# Altium schematic sheet ETRX_Shield.SchDoc
size A4; DocumentNumber: 1; SheetNumber: 1; SheetTotal: 4
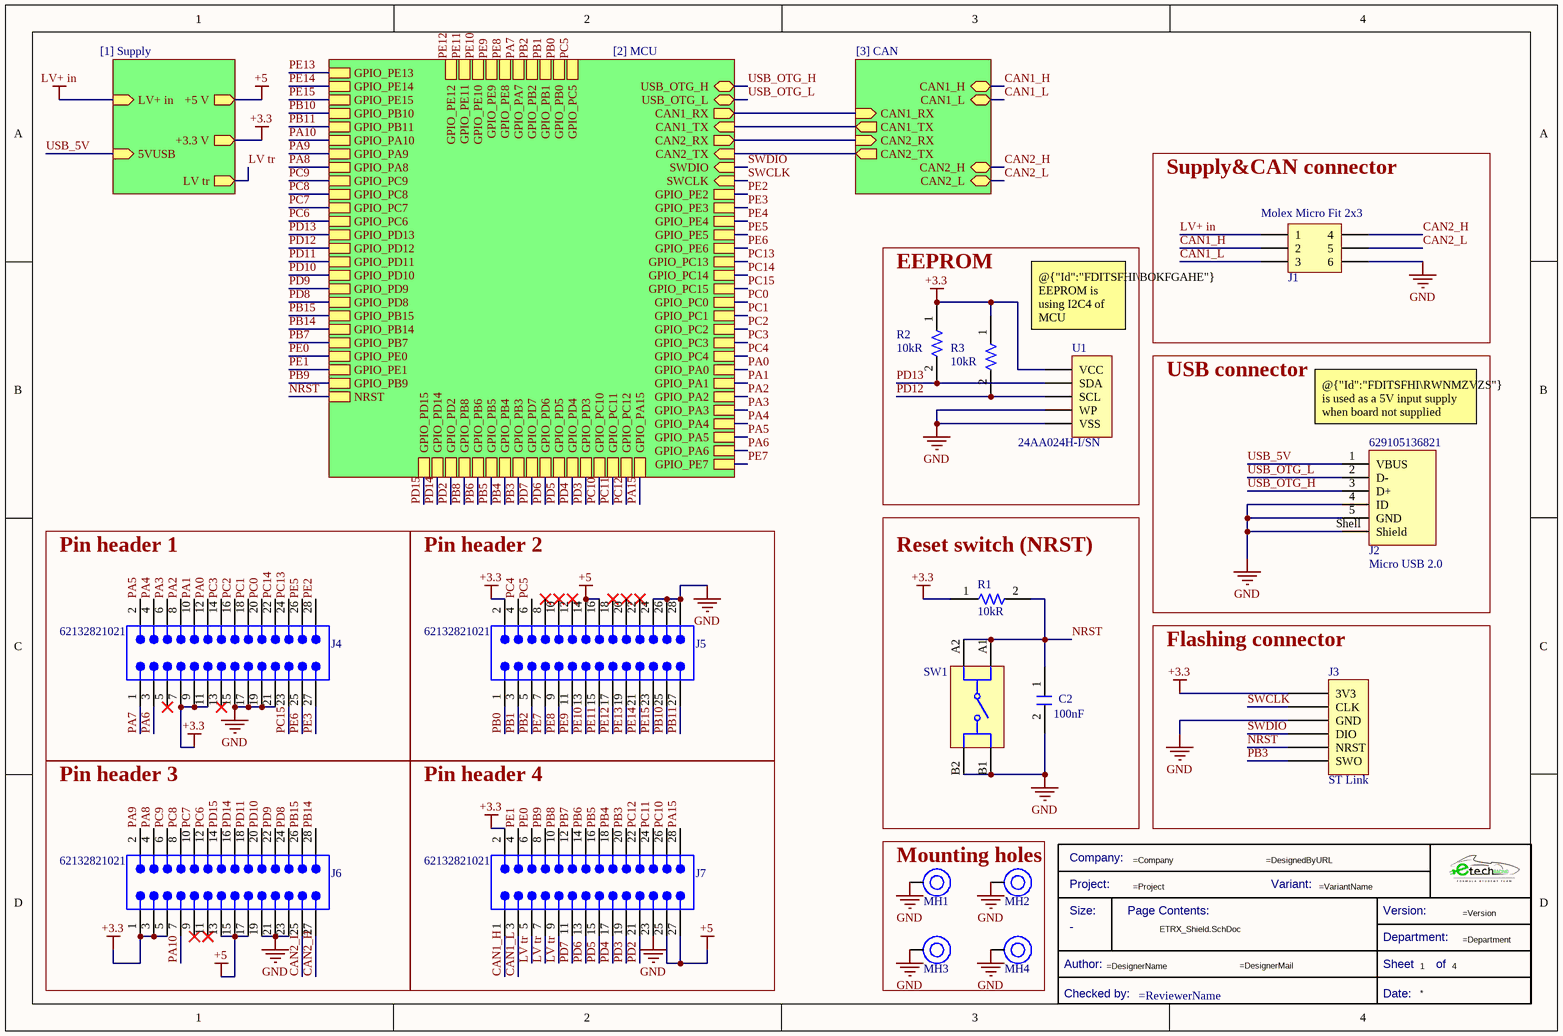
[diagram p0: ETRX_Shield.SchDoc]

## Parts
*  Title Block_template  (value not drawn)  (graphical)
C2  Capacitance: 100nF  [C0805FNPC-R]  (hidden comment: 885012207098)
J1  Molex Micro Fit 2x3  [J_MicroFit_2x3_V]
J2  629105136821  [629105136821]
J3  ST Link  [J_STLink_PinHeader]
J4  62132821021  [62132821021]
J5  62132821021  [62132821021]
J6  62132821021  [62132821021]
J7  62132821021  [62132821021]
MH1  Mounting_Hole_M3  [Mounting_Hole_M3]  (value not drawn)
MH2  Mounting_Hole_M3  [Mounting_Hole_M3]  (value not drawn)
MH3  Mounting_Hole_M3  [Mounting_Hole_M3]  (value not drawn)
MH4  Mounting_Hole_M3  [Mounting_Hole_M3]  (value not drawn)
R1  Resistance: 10kR  [R0805FTK]  (hidden comment: CR0805-JW-103ELF)
R2  Resistance: 10kR  [R0805FTK]  (hidden comment: CR0805-JW-103ELF)
R3  Resistance: 10kR  [R0805FTK]  (hidden comment: CR0805-JW-103ELF)
SW1  430773034825  [WS-TASV_L6W6H3.4_4307x30348xx]  (value not drawn)
U1  24AA024H-I/SN  [SOIC, 8-Leads 1,27mm]

## Blocks framed on the sheet
Supply&CAN connector: J1
EEPROM: R2 R3 U1
USB connector: J2
Reset switch (NRST): C2 R1 SW1
Pin header 1: J4
Pin header 2: J5
Flashing connector: J3
Pin header 3: J6
Pin header 4: J7
Mounting holes: MH1-MH4

## Sub-sheets
[1] Supply = [1] Supply: LV+ in (in), +5 V (out), +3.3 V (out), LV tr (out), 5VUSB (in)
[2] MCU = [2] MCU: CAN1_RX (out), CAN1_TX (in), CAN2_RX (out), CAN2_TX (in), USB_OTG_H (bidir), USB_OTG_L (bidir), SWDIO (in), SWCLK (in), GPIO_PE2, GPIO_PE3, GPIO_PE4, GPIO_PE5, GPIO_PC13, GPIO_PC14, GPIO_PC15, GPIO_PC0, GPIO_PC1, GPIO_PC2, GPIO_PC3, GPIO_PA0, GPIO_PA1, GPIO_PA2, GPIO_PA3, GPIO_PA4, GPIO_PA5, GPIO_PC4, GPIO_PC5, GPIO_PB0, GPIO_PB1, GPIO_PB2, GPIO_PE8, GPIO_PE9, GPIO_PE10, GPIO_PE11, GPIO_PE12, GPIO_PE13, GPIO_PE14, GPIO_PE15, GPIO_PB10, GPIO_PB11, GPIO_PA8, GPIO_PC9, GPIO_PC8, GPIO_PC7, GPIO_PC6, GPIO_PD13, GPIO_PD12, GPIO_PD11, GPIO_PD10, GPIO_PD9, GPIO_PD8, GPIO_PB15, GPIO_PB14, GPIO_PB7, GPIO_PE1, GPIO_PE0, GPIO_PB9, GPIO_PB8, GPIO_PB6, GPIO_PB5, GPIO_PB4, GPIO_PB3, GPIO_PD7, GPIO_PD6, GPIO_PD5, GPIO_PD4, GPIO_PD3, GPIO_PD2, GPIO_PC12, GPIO_PC11, GPIO_PC10, GPIO_PA15, GPIO_PA10, GPIO_PE6, GPIO_PA6, GPIO_PA7, GPIO_PE7, NRST, GPIO_PD14, GPIO_PD15, GPIO_PA9
[3] CAN = [3] CAN: CAN1_H (bidir), CAN1_L (bidir), CAN2_H (bidir), CAN2_L (bidir), CAN1_RX (in), CAN2_RX (in), CAN1_TX (out), CAN2_TX (out)

## Nets
+3.3: J3.1(3V3) J4.7 J4.9 J4.11 J5.2 J6.1 J6.3 J6.5 J7.2 R1.1 R2.1 R3.1 U1.8(VCC) ; sheet [1] Supply/+3.3 V
+5: J5.14 J5.16 J6.13 J6.15 J6.17 J7.25 J7.27 ; sheet [1] Supply/+5 V
GND: C2.2 J1.6 J2.4(ID) J2.5(GND) J2.Shell(Shield) J3.3(GND) J4.15 J4.17 J4.19 J4.21 J5.24 J5.26 J5.28 J6.19 J6.21 J6.23 J7.23 MH1.1 MH2.1 MH3.1 MH4.1 SW1.B1 SW1.B2 U1.4(VSS) U1.7(WP)
LV+ in: J1.1 ; sheet [1] Supply/LV+ in
CAN1_H: J1.2 J7.1 ; sheet [3] CAN/CAN1_H
CAN1_L: J1.3 J7.3 ; sheet [3] CAN/CAN1_L
CAN2_H: J1.4 J6.27 ; sheet [3] CAN/CAN2_H
CAN2_L: J1.5 J6.25 ; sheet [3] CAN/CAN2_L
LV tr: J7.5 J7.7 J7.9 ; sheet [1] Supply/LV tr
NRST: C2.1 J3.5(NRST) R1.2 SW1.A1 SW1.A2 ; sheet [2] MCU/NRST
PA0: J4.12 ; sheet [2] MCU/GPIO_PA0
PA1: J4.10 ; sheet [2] MCU/GPIO_PA1
PA2: J4.8 ; sheet [2] MCU/GPIO_PA2
PA3: J4.6 ; sheet [2] MCU/GPIO_PA3
PA4: J4.4 ; sheet [2] MCU/GPIO_PA4
PA5: J4.2 ; sheet [2] MCU/GPIO_PA5
PA6: J4.3 ; sheet [2] MCU/GPIO_PA6
PA7: J4.1 ; sheet [2] MCU/GPIO_PA7
PA8: J6.4 ; sheet [2] MCU/GPIO_PA8
PA9: J6.2 ; sheet [2] MCU/GPIO_PA9
PA10: J6.7 ; sheet [2] MCU/GPIO_PA10
PA15: J7.28 ; sheet [2] MCU/GPIO_PA15
PB0: J5.1 ; sheet [2] MCU/GPIO_PB0
PB1: J5.3 ; sheet [2] MCU/GPIO_PB1
PB2: J5.5 ; sheet [2] MCU/GPIO_PB2
PB3: J3.6(SWO) J7.20 ; sheet [2] MCU/GPIO_PB3
PB4: J7.18 ; sheet [2] MCU/GPIO_PB4
PB5: J7.16 ; sheet [2] MCU/GPIO_PB5
PB6: J7.14 ; sheet [2] MCU/GPIO_PB6
PB7: J7.12 ; sheet [2] MCU/GPIO_PB7
PB8: J7.10 ; sheet [2] MCU/GPIO_PB8
PB9: J7.8 ; sheet [2] MCU/GPIO_PB9
PB10: J5.25 ; sheet [2] MCU/GPIO_PB10
PB11: J5.27 ; sheet [2] MCU/GPIO_PB11
PB14: J6.28 ; sheet [2] MCU/GPIO_PB14
PB15: J6.26 ; sheet [2] MCU/GPIO_PB15
PC0: J4.20 ; sheet [2] MCU/GPIO_PC0
PC1: J4.18 ; sheet [2] MCU/GPIO_PC1
PC2: J4.16 ; sheet [2] MCU/GPIO_PC2
PC3: J4.14 ; sheet [2] MCU/GPIO_PC3
PC4: J5.4 ; sheet [2] MCU/GPIO_PC4
PC5: J5.6 ; sheet [2] MCU/GPIO_PC5
PC6: J6.12 ; sheet [2] MCU/GPIO_PC6
PC7: J6.10 ; sheet [2] MCU/GPIO_PC7
PC8: J6.8 ; sheet [2] MCU/GPIO_PC8
PC9: J6.6 ; sheet [2] MCU/GPIO_PC9
PC10: J7.26 ; sheet [2] MCU/GPIO_PC10
PC11: J7.24 ; sheet [2] MCU/GPIO_PC11
PC12: J7.22 ; sheet [2] MCU/GPIO_PC12
PC13: J4.24 ; sheet [2] MCU/GPIO_PC13
PC14: J4.22 ; sheet [2] MCU/GPIO_PC14
PC15: J4.23 ; sheet [2] MCU/GPIO_PC15
PD2: J7.21 ; sheet [2] MCU/GPIO_PD2
PD3: J7.19 ; sheet [2] MCU/GPIO_PD3
PD4: J7.17 ; sheet [2] MCU/GPIO_PD4
PD5: J7.15 ; sheet [2] MCU/GPIO_PD5
PD6: J7.13 ; sheet [2] MCU/GPIO_PD6
PD7: J7.11 ; sheet [2] MCU/GPIO_PD7
PD8: J6.24 ; sheet [2] MCU/GPIO_PD8
PD9: J6.22 ; sheet [2] MCU/GPIO_PD9
PD10: J6.20 ; sheet [2] MCU/GPIO_PD10
PD11: J6.18 ; sheet [2] MCU/GPIO_PD11
PD12: R3.2 U1.6(SCL) ; sheet [2] MCU/GPIO_PD12
PD13: R2.2 U1.5(SDA) ; sheet [2] MCU/GPIO_PD13
PD14: J6.16 ; sheet [2] MCU/GPIO_PD14
PD15: J6.14 ; sheet [2] MCU/GPIO_PD15
PE0: J7.6 ; sheet [2] MCU/GPIO_PE0
PE1: J7.4 ; sheet [2] MCU/GPIO_PE1
PE2: J4.28 ; sheet [2] MCU/GPIO_PE2
PE3: J4.27 ; sheet [2] MCU/GPIO_PE3
PE4: sheet [2] MCU/GPIO_PE4
PE5: J4.26 ; sheet [2] MCU/GPIO_PE5
PE6: J4.25 ; sheet [2] MCU/GPIO_PE6
PE7: J5.7 ; sheet [2] MCU/GPIO_PE7
PE8: J5.9 ; sheet [2] MCU/GPIO_PE8
PE9: J5.11 ; sheet [2] MCU/GPIO_PE9
PE10: J5.13 ; sheet [2] MCU/GPIO_PE10
PE11: J5.15 ; sheet [2] MCU/GPIO_PE11
PE12: J5.17 ; sheet [2] MCU/GPIO_PE12
PE13: J5.19 ; sheet [2] MCU/GPIO_PE13
PE14: J5.21 ; sheet [2] MCU/GPIO_PE14
PE15: J5.23 ; sheet [2] MCU/GPIO_PE15
SWCLK: J3.2(CLK) ; sheet [2] MCU/SWCLK
SWDIO: J3.4(DIO) ; sheet [2] MCU/SWDIO
USB_5V: J2.1(VBUS) ; sheet [1] Supply/5VUSB
USB_OTG_H: J2.3(D+) ; sheet [2] MCU/USB_OTG_H
USB_OTG_L: J2.2(D-) ; sheet [2] MCU/USB_OTG_L
(unnamed): sheet [2] MCU/CAN1_RX, sheet [3] CAN/CAN1_RX
(unnamed): sheet [2] MCU/CAN1_TX, sheet [3] CAN/CAN1_TX
(unnamed): sheet [2] MCU/CAN2_RX, sheet [3] CAN/CAN2_RX
(unnamed): sheet [2] MCU/CAN2_TX, sheet [3] CAN/CAN2_TX

Not connected (* = marked no-connect by the designer): J4 5* 13*; J5 8* 10* 12* 18* 20* 22*; J6 9* 11*

## Notes on the sheet
- @{"Id":"FDITSFHI\BOKFGAHE"} EEPROM is using I2C4 of MCU
- (near J2) @{"Id":"FDITSFHI\RWNMZVZS"} is used as a 5V input supply when board not supplied externaly
- (near J2) Micro USB 2.0
- (in symbol Title Block_template) Company:; Project:; Variant:; Size:; Page Contents:; Version:; Department:; Author:; Sheet; of; Checked by:; Date:

## Library data of the parts
* = Title Block_template: Standard Title Block; .Creator: GP; Category: Title Block; .PCBcheck: GP; .SCHcheck: GP; Checked by:: =ReviewerName; Size: -
C2 = C100n-50V-0805FNPC-X7R: Cap, 0.1ΜF, 50V, 10%, X7R, 0805; Manufacturer 1: Wurth Electronics; .Creator: DR; Supplier 1: RSComponents; Manufacturer Part Number 1: 885012207098; RoHS: Yes; Category: Ceramic Capacitors; Stock 1: 8000; Pricing 1: 100=0,10200, 500=0,07100, 2000=0,06100 (GBP); Mount: Surface Mount; Case/Package: 0805; Case Code (Metric): 2012; Case Code (Imperial): 0805; Min Operating Temperature: -55°C; Max Operating Temperature: 125°C; Packaging: Cut Tape; Voltage Rating: 50V; Dielectric: X7R; Tolerance: 10%; Voltage Rating (DC): 50V; Length: 0.079inch; Width: 0.049inch; Thickness: 0.035inch; REACH SVHC: Unknown; RoHS Compliant: Yes; ComponentLink1URL: http://www.farnell.com/datasheets/1958498.pdf?src-supplier=Farnell; ComponentLink1Description: http://www.farnell.com/datasheets/1958498.pdf?src-supplier=Farnell; ComponentLink2URL: http://www.farnell.com/datasheets/1958498.pdf?src-supplier=Element14; ComponentLink2Description: http://www.farnell.com/datasheets/1958498.pdf?src-supplier=Element14; ComponentLink3URL: https://katalog.we-online.de/pbs/datasheet/885012207098.pdf?src-supplier=Digi-Key; ComponentLink3Description: https://katalog.we-online.de/pbs/datasheet/885012207098.pdf?src-supplier=Digi-Key; ComponentLink4URL: http://www.farnell.com/datasheets/1958498.pdf?src-supplier=Newark; ComponentLink4Description: http://www.farnell.com/datasheets/1958498.pdf?src-supplier=Newark; Supplier Part Number 1: 1813493
J1 = J_MicroFit_2x3_V: Micro fit Header, 2 Row, Vertical, Polarizing Peg, 6 Pin, Tin Plate, SMT/Glow Wire, Kinked Leads; Manufacturer Part Number: 43045-0612; .Creator: DO; ComponentLink8Description: Where buy it; ComponentLink8URL: https://www.molex.com/molex/products/part-detail/pcb_headers/0430450612; Supplier 1: RSComponents; Manufacturer: Molex; RoHS: Yes; Category: Headers and Wire Housings; Stock 1: 2635; Pricing 1: 5=1,45500, 100=1,26700, 375=1,08900, 1500=0,90900, 3000=0,72900 (USD); ComponentLink1URL: https://www.molex.com/pdm_docs/sd/430450612_sd.pdf; ComponentLink1Description: Datasheet; ComponentLink2URL: https://datasheet.ciiva.com/11748/0900766b800bd7d2-11748707.pdf?src-supplier=RSComponents; ComponentLink2Description: https://datasheet.ciiva.com/11748/0900766b800bd7d2-11748707.pdf?src-supplier=RSComponents; ComponentLink3URL: https://datasheet.ciiva.com/19462/883464-19462371.pdf?src-supplier=Jameco; ComponentLink3Description: https://datasheet.ciiva.com/19462/883464-19462371.pdf?src-supplier=Jameco; ComponentLink4URL: https://datasheet.ciiva.com/30194/128550430450612-pcb-headers-30194512.pdf?src-supplier=Onlinecomponents.com; ComponentLink4Description: https://datasheet.ciiva.com/30194/128550430450612-pcb-headers-30194512.pdf?src-supplier=Onlinecomponents.com; ComponentLink5URL: https://datasheet.ciiva.com/9468/0430450612-pcb-headers-9468492.pdf?src-supplier=Avnet; ComponentLink5Description: https://datasheet.ciiva.com/9468/0430450612-pcb-headers-9468492.pdf?src-supplier=Avnet; Supplier Part Number 1: 2332898
J2 = 629105136821: WR-COM Micro USB 2.0 SMT Type B Horizontal 5 Contacts; Manufacturer: Wurth Elektronik; Match Code: WR-USB; Gender: Receptacle; Interface Type: Type B; Number of Ports: 1; Rated Current: 1A; Working Voltage: 30V (AC); Manufacturer Part Number: 629105136821; Category: Input/Output Connectors; ComponentLink1Description: Website Link; ComponentLink1URL: https://www.we-online.com/redexpert/article/629105136821?ad; ComponentLink2Description: Datasheet Link; ComponentLink2URL: https://www.we-online.com/redexpert/spec/629105136821?ad; Mount: Surface Mount; Operating Temperature Max: 105°C; Operating Temperature Min: -40°C; Packaging: Tape and Reel; Application: Micro USB 2.0; Number of Pins: 5; Orientation: Horizontal
J3 = J_STLink_STM32_PinHeader_1x6
J4-J7 = 62132821021: WR-PHD Pin Header, SMT, Vertical, pitch 1.27mm, 2 Row, 28P; Manufacturer: Wurth Elektronik; Contact Resistance: 20mΩ; Rated Current: 1A; Working Voltage: 100V; Withstanding Voltage: 500V; ComponentLink1Description: Website Link; ComponentLink1URL: https://www.we-online.com/redexpert/article/62132821021?ad; ComponentLink2Description: Datasheet Link; ComponentLink2URL: https://www.we-online.com/redexpert/spec/62132821021?ad; Manufacturer Part Number: 62132821021; Category: Board-to-Board Connectors; Match Code: WR-PHD; Mount: Surface Mount; Operating Temperature Max: 105°C; Operating Temperature Min: -40°C; Packaging: Tape and Reel; Gender: Pin Header; Number of Pins: 28; Number of Rows: 2; Orientation: Vertical; Pitch: 1.27mm
R1-R3 = R10k-0805FTK: BOURNS         CR0805-JW-103ELF            Surface Mount Chip Resistor, Thick Film, CR Series, 10 kohm, 125 mW,  5%, 150 V; Temperature Coefficient: 200ppm/°C; Power Rating: 125mW; Voltage Rating: 150V; Voltage Rating (DC): 100V; .Creator: DR; Supplier 1: Arrow Electronics; Manufacturer 1: Bourns; Manufacturer Part Number 1: CR0805-JW-103ELF; RoHS: Yes; Category: Chip SMD Resistors; Stock 1: 57566; Pricing 1: 1=0,05790, 10=0,01540, 25=0,01340, 100=0,00340 (USD); Mount: Surface Mount; Case/Package: 0805; Number of Pins: 2; Contact Plating: Tin; Case Code (Metric): 2012; Case Code (Imperial): 0805; Min Operating Temperature: -55°C; Max Operating Temperature: 155°C; Tolerance: 5%; Resistor Type: Thick Film; Package Quantity: 1; Packaging: Tape and Reel; Number of Terminations: 2; Termination: SMD/SMT; Max Power Dissipation: 125mW; Features: Moisture Resistant; Series: CR0805; Construction: Rectangular; Resistance Tolerance: 5%; Technology: THICK FILM; Length: 2mm; Width: 1.25mm; Height: 0.5mm; Depth: 1.25mm; Thickness: 508um; Radiation Hardening: No; REACH SVHC: No SVHC; Military Standard: Not; RoHS Compliant: Yes; ComponentLink1URL: https://datasheet.ciiva.com/11821/0900766b80fcdb72-11821135.pdf?src-supplier=RSComponents; ComponentLink1Description: https://datasheet.ciiva.com/11821/0900766b80fcdb72-11821135.pdf?src-supplier=RSComponents; ComponentLink2URL: https://datasheet.ciiva.com/9122/chpreztr-9122374.pdf?src-supplier=Avnet; ComponentLink2Description: https://datasheet.ciiva.com/9122/chpreztr-9122374.pdf?src-supplier=Avnet; ComponentLink3URL: https://datasheet.ciiva.com/22693/1902866-22693254.pdf?src-supplier=Element14; ComponentLink3Description: https://datasheet.ciiva.com/22693/1902866-22693254.pdf?src-supplier=Element14; ComponentLink4URL: https://datasheet.ciiva.com/7986/691949-7986187.pdf?src-supplier=Element14; ComponentLink4Description: https://datasheet.ciiva.com/7986/691949-7986187.pdf?src-supplier=Element14; ComponentLink5URL: https://datasheet.ciiva.com/30065/159chpreztr-30065976.pdf?src-supplier=Onlinecomponents.com; ComponentLink5Description: https://datasheet.ciiva.com/30065/159chpreztr-30065976.pdf?src-supplier=Onlinecomponents.com; ComponentLink6URL: https://datasheet.ciiva.com/16783/70154685-16783482.pdf?src-supplier=Allied+Electronics; ComponentLink6Description: https://datasheet.ciiva.com/16783/70154685-16783482.pdf?src-supplier=Allied+Electronics; ComponentLink7URL: https://datasheet.ciiva.com/5548/chpreztr-5548491.pdf?src-supplier=Mouser; ComponentLink7Description: https://datasheet.ciiva.com/5548/chpreztr-5548491.pdf?src-supplier=Mouser; ComponentLink8URL: https://datasheet.ciiva.com/6559/chpreztr-6559900.pdf?src-supplier=Digi-Key; ComponentLink8Description: https://datasheet.ciiva.com/6559/chpreztr-6559900.pdf?src-supplier=Digi-Key; ComponentLink9URL: https://datasheet.ciiva.com/6559/chpreztr-6559901.pdf?src-supplier=Digi-Key; ComponentLink9Description: https://datasheet.ciiva.com/6559/chpreztr-6559901.pdf?src-supplier=Digi-Key; ComponentLink10URL: https://datasheet.ciiva.com/7985/1856384-7985869.pdf?src-supplier=Element14; ComponentLink10Description: https://datasheet.ciiva.com/7985/1856384-7985869.pdf?src-supplier=Element14; ComponentLink11URL: https://datasheet.ciiva.com/48692/001055517-da-01-en-smd-wid-cr0805-jw-103elf-10k-ohm-1-8w-48692118.pdf?src-supplier=Conrad; ComponentLink11Description: https://datasheet.ciiva.com/48692/001055517-da-01-en-smd-wid-cr0805-jw-103elf-10k-ohm-1-8w-48692118.pdf?src-supplier=Conrad; Supplier Part Number 1: CR0805-JW-103ELF
SW1 = 430773034825: WS-TASV J-Hook SMT Hermetic Tact Switch, L6 x W6 x H3.4mm, 250g, SPST-NO, 12V, 50mA; Manufacturer: Wurth Elektronik; Washable: Yes; Manufacturer Part Number: 430773034825; Category: Tact Switches; Match Code: WS-TASV; ComponentLink1Description: Website Link; ComponentLink1URL: https://www.we-online.com/redexpert/article/430773034825?ad; ComponentLink2Description: Datasheet Link; ComponentLink2URL: https://www.we-online.com/redexpert/spec/430773034825?ad; Mount: Surface Mount; Operating Temperature Max: 85°C; Operating Temperature Min: -40°C; Packaging: Tape and Reel; Length: 6mm; Width: 6mm; Height: 3.4mm; Circuit: SPST-NO; Contact Material: Stainless Steel; Contact Plating: Silver; Operation Force: 250g; Rated Current: 50mA; Rated Voltage (DC): 12V; Terminal Material: Copper Alloy; Terminal Plating: Silver
U1 = EEPROM 24AA02I2C 2K Microchip: 24AA02 / 2Kb I2C compatible 2-wire Serial EEPROM; Supplier 1: Arrow Electronics; Supplier Part Number 1: 24AA02-I/SN; ComponentLink1Description: Datasheet; ComponentLink1URL: https://ww1.microchip.com/downloads/aemDocuments/documents/MPD/ProductDocuments/DataSheets/24AA02-24LC02B-24FC02-2K-I2C-Serial-EEPROM-20001709N.pdf